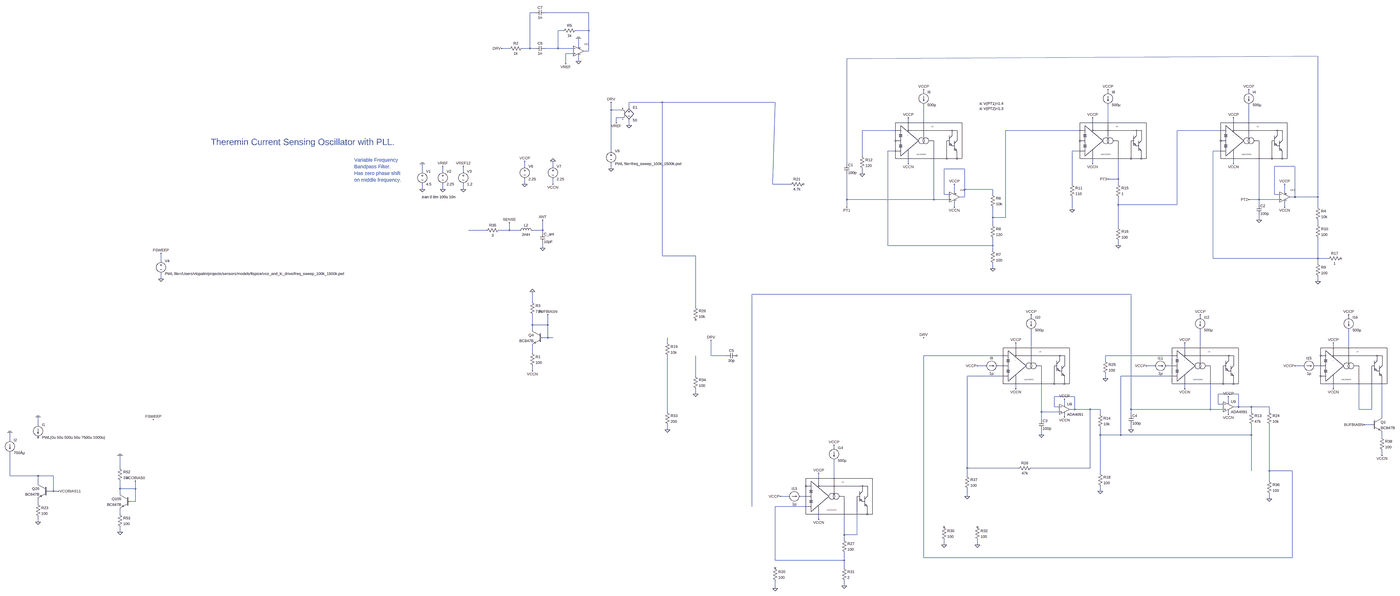
[diagram p0: schematic vco_and_lc_drive_v10.asc, whole sheet]
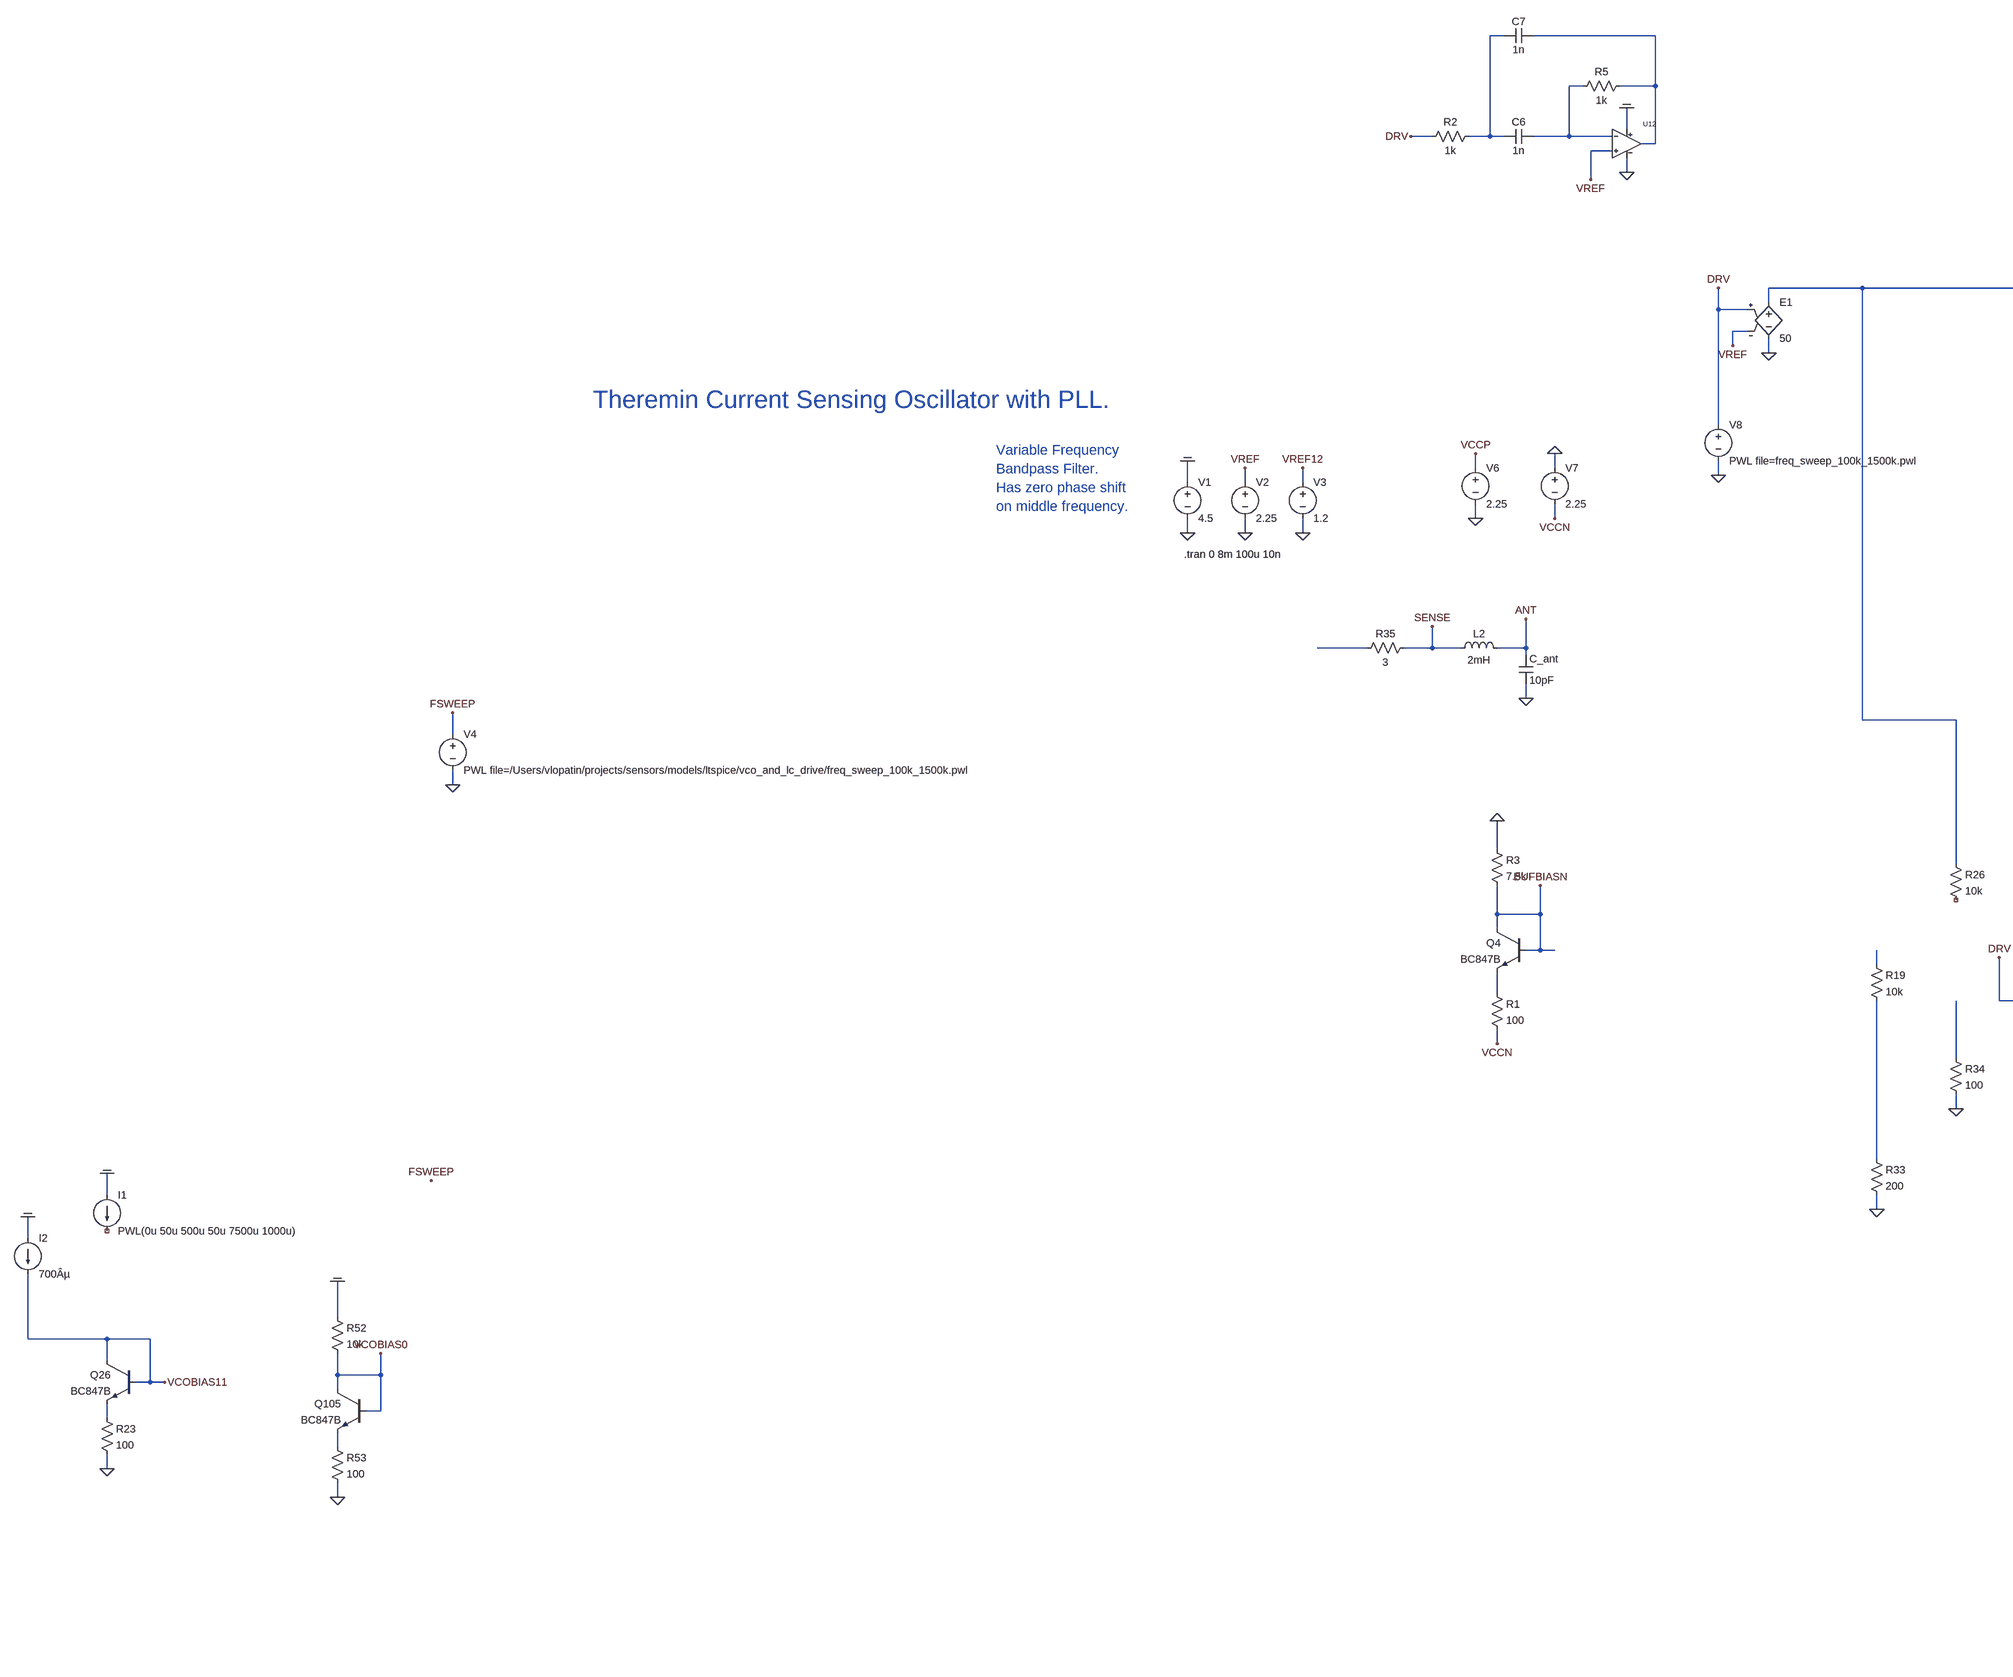
[diagram p1: schematic vco_and_lc_drive_v10.asc, part, row 1 of 1, column 1 of 2]
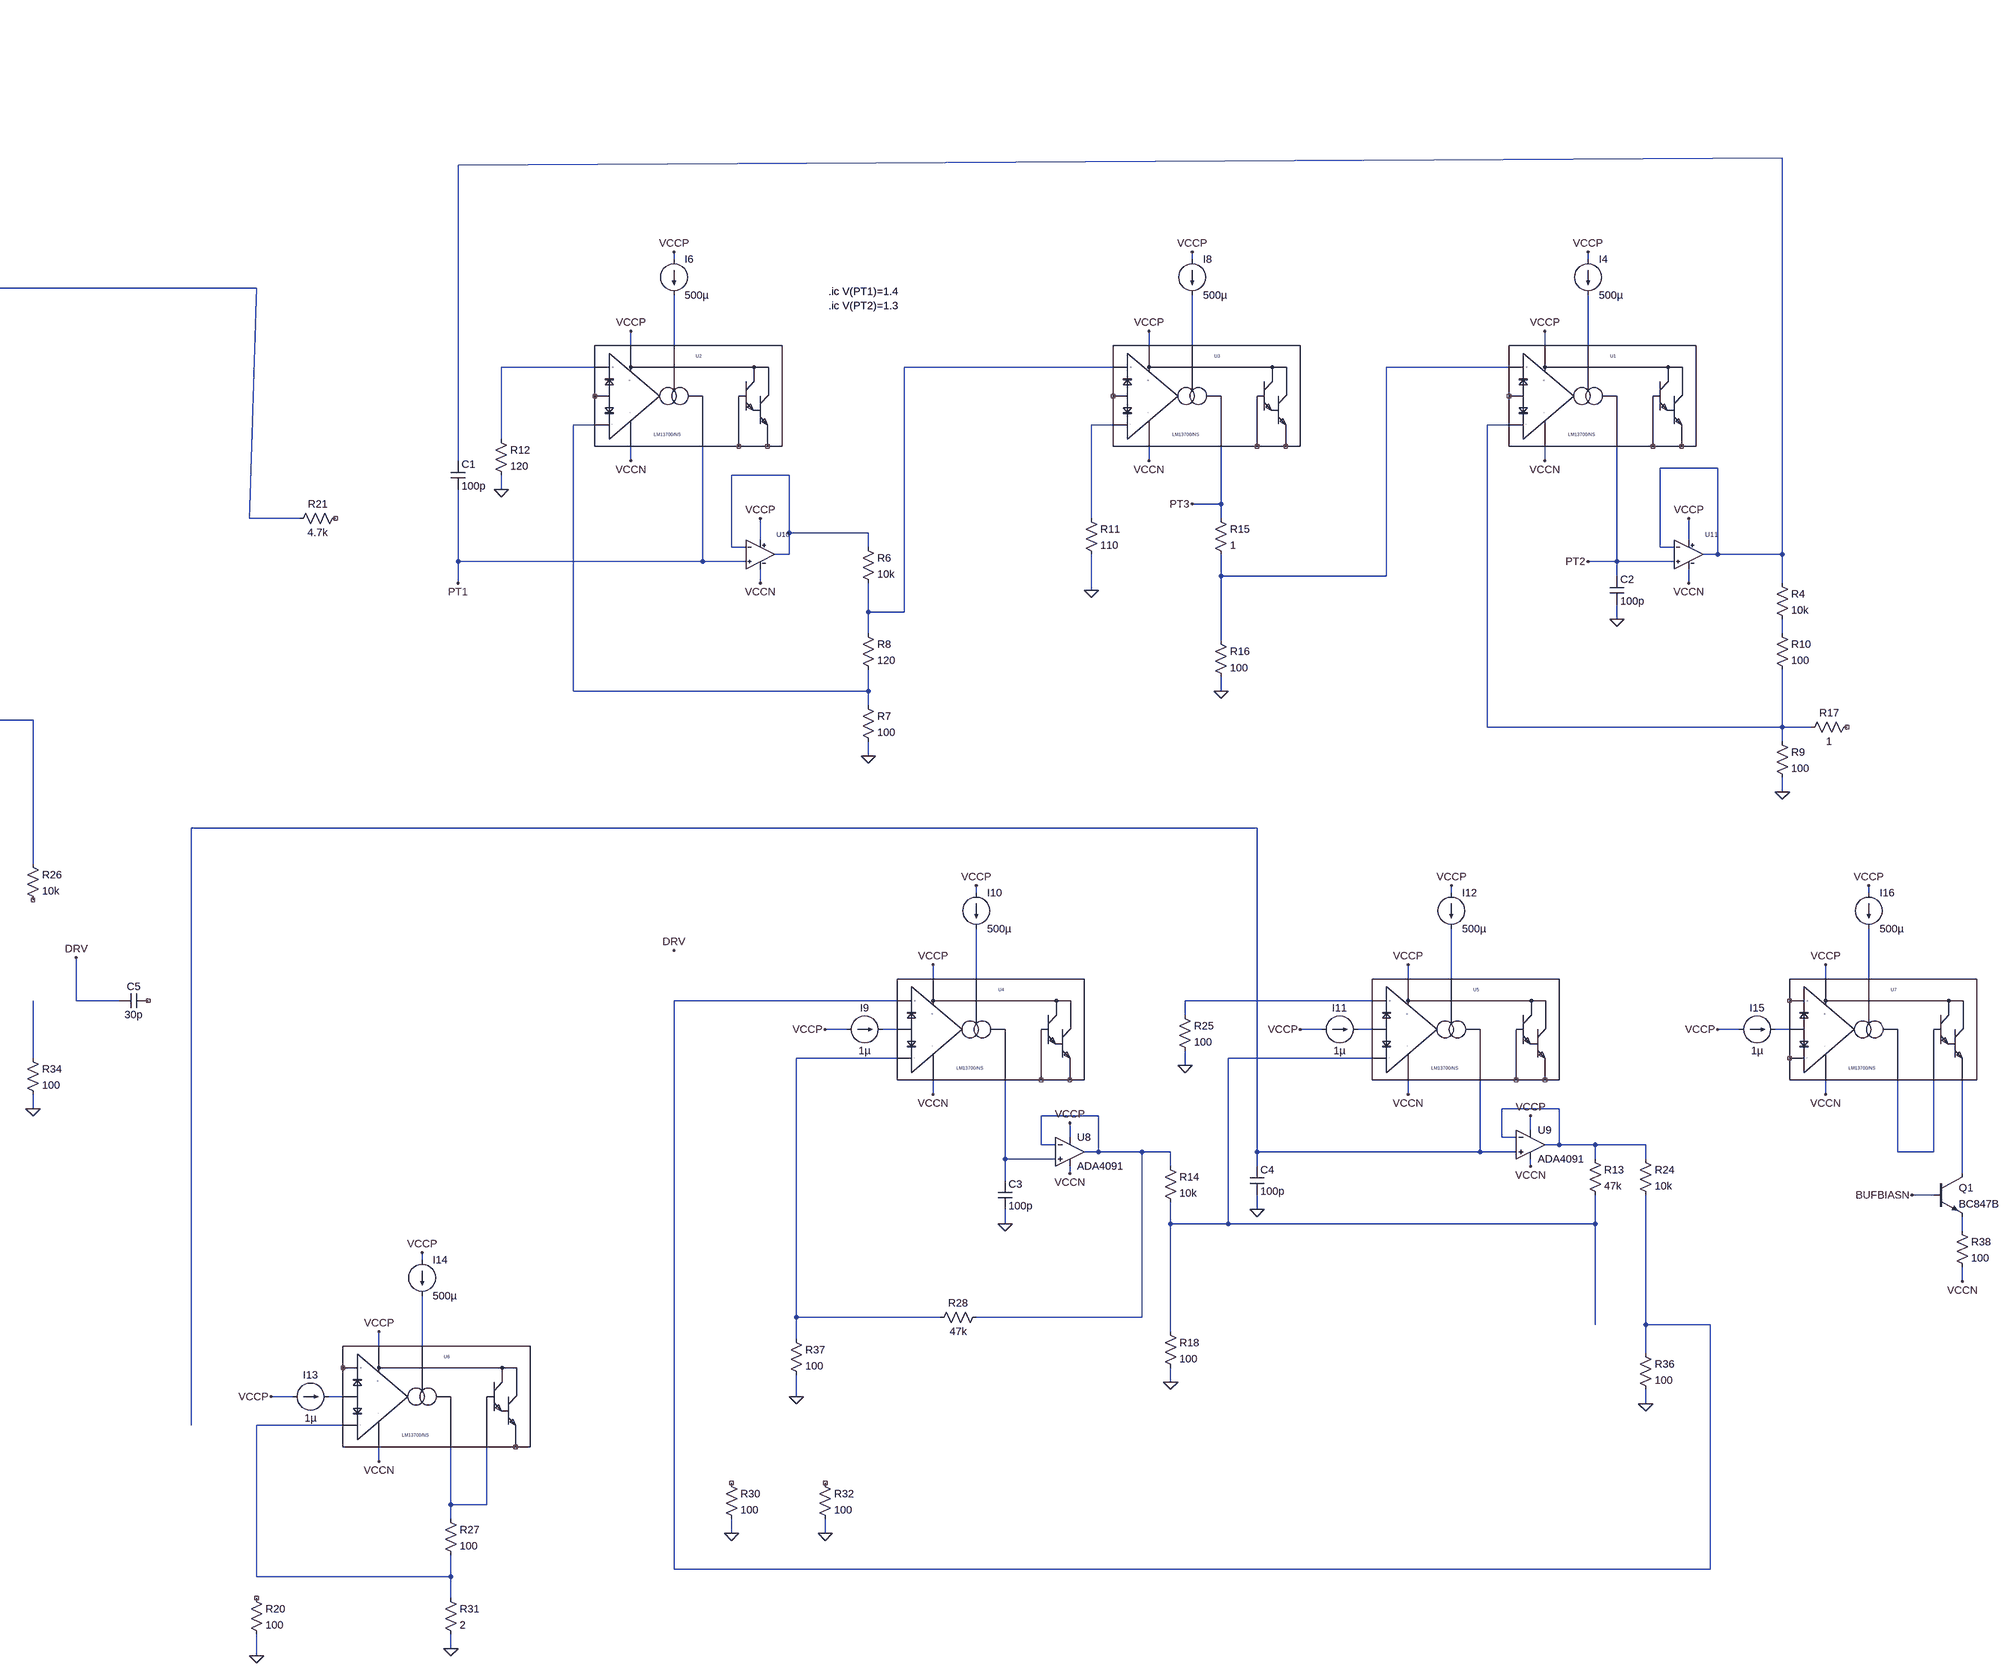
[diagram p2: schematic vco_and_lc_drive_v10.asc, part, row 1 of 1, column 2 of 2]
vco_and_lc_drive_v10.asc, the LTspice schematic file:
Version 4
SHEET 1 13504 24832
WIRE -4896 18064 -4928 18064
WIRE -4560 18064 -4832 18064
WIRE -4720 18176 -4752 18176
WIRE -4560 18176 -4560 18064
WIRE -4560 18176 -4640 18176
WIRE -4624 18272 -4624 18224
WIRE -5056 18288 -5104 18288
WIRE -4928 18288 -4928 18064
WIRE -4928 18288 -4976 18288
WIRE -4896 18288 -4928 18288
WIRE -4752 18288 -4752 18176
WIRE -4752 18288 -4832 18288
WIRE -4656 18288 -4752 18288
WIRE -4560 18304 -4560 18176
WIRE -4560 18304 -4592 18304
WIRE -4656 18320 -4704 18320
WIRE -1984 18352 960 18336
WIRE -4624 18368 -4624 18336
WIRE -4704 18384 -4704 18320
WIRE -1504 18576 -1504 18560
WIRE -352 18576 -352 18560
WIRE 528 18576 528 18560
WIRE -3232 18640 -3440 18640
WIRE -2432 18640 -3232 18640
WIRE -3440 18672 -3440 18640
WIRE -3552 18688 -3552 18640
WIRE -3488 18688 -3552 18688
WIRE -3488 18736 -3520 18736
WIRE -3520 18768 -3520 18736
WIRE -1600 18768 -1600 18736
WIRE -1504 18768 -1504 18656
WIRE -448 18768 -448 18736
WIRE -352 18768 -352 18656
WIRE 432 18768 432 18736
WIRE 528 18768 528 18656
WIRE -3440 18784 -3440 18752
WIRE -1680 18816 -1888 18816
WIRE -528 18816 -992 18816
WIRE 352 18816 80 18816
WIRE -3552 18944 -3552 18688
WIRE -1680 18944 -1728 18944
WIRE -528 18944 -576 18944
WIRE 352 18944 304 18944
WIRE -1888 18976 -1888 18816
WIRE -1984 19024 -1984 18352
WIRE -1600 19024 -1600 18992
WIRE -448 19024 -448 18992
WIRE 432 19024 432 18992
WIRE -4960 19040 -4960 19008
WIRE -4784 19040 -4784 19008
WIRE 816 19040 688 19040
WIRE -3552 19056 -3552 19024
WIRE -1248 19056 -1376 19056
WIRE -5600 19072 -5600 19024
WIRE -5472 19072 -5472 19040
WIRE -5344 19072 -5344 19040
WIRE -1888 19088 -1888 19056
WIRE -288 19120 -288 18992
WIRE -288 19120 -352 19120
WIRE -4960 19152 -4960 19120
WIRE -4784 19152 -4784 19120
WIRE -2448 19152 -2432 18640
WIRE -2336 19152 -2448 19152
WIRE -576 19152 -576 18944
WIRE -288 19152 -288 19120
WIRE -5600 19184 -5600 19152
WIRE -5472 19184 -5472 19152
WIRE -5344 19184 -5344 19152
WIRE -1248 19184 -1248 19056
WIRE -1072 19184 -1248 19184
WIRE -1312 19200 -1312 19152
WIRE 752 19200 752 19152
WIRE -1376 19216 -1376 19056
WIRE -1344 19216 -1376 19216
WIRE -1072 19216 -1072 19184
WIRE 688 19216 688 19040
WIRE 720 19216 688 19216
WIRE -1248 19232 -1248 19184
WIRE -1248 19232 -1280 19232
WIRE 816 19232 816 19040
WIRE 816 19232 784 19232
WIRE 960 19232 960 18336
WIRE 960 19232 816 19232
WIRE -1984 19248 -1984 19088
WIRE -1440 19248 -1440 18992
WIRE -1440 19248 -1984 19248
WIRE -1344 19248 -1440 19248
WIRE 592 19248 592 18992
WIRE 592 19248 528 19248
WIRE 720 19248 592 19248
WIRE -288 19280 -288 19232
WIRE 80 19280 80 18816
WIRE 80 19280 -288 19280
WIRE 592 19280 592 19248
WIRE -1984 19296 -1984 19248
WIRE -1312 19296 -1312 19264
WIRE 752 19296 752 19264
WIRE 960 19296 960 19232
WIRE -576 19312 -576 19232
WIRE -1072 19360 -1072 19296
WIRE -992 19360 -992 18816
WIRE -992 19360 -1072 19360
WIRE 592 19376 592 19344
WIRE -1072 19408 -1072 19360
WIRE 960 19408 960 19376
WIRE -288 19424 -288 19280
WIRE -5200 19440 -5312 19440
WIRE -5056 19440 -5056 19392
WIRE -5056 19440 -5120 19440
WIRE -4992 19440 -5056 19440
WIRE -4848 19440 -4848 19376
WIRE -4848 19440 -4912 19440
WIRE -4848 19456 -4848 19440
WIRE -1728 19536 -1728 18944
WIRE -1072 19536 -1072 19488
WIRE -1072 19536 -1728 19536
WIRE -288 19536 -288 19504
WIRE -4848 19552 -4848 19520
WIRE -1072 19568 -1072 19536
WIRE -3232 19600 -3232 18640
WIRE -3024 19600 -3232 19600
WIRE 304 19616 304 18944
WIRE 960 19616 960 19488
WIRE 960 19616 304 19616
WIRE 1024 19616 960 19616
WIRE -7648 19632 -7648 19584
WIRE 960 19648 960 19616
WIRE -1072 19680 -1072 19648
WIRE -7648 19744 -7648 19712
WIRE 960 19760 960 19728
WIRE -208 19840 -2672 19840
WIRE -4912 19888 -4912 19824
WIRE -3024 19920 -3024 19600
WIRE -832 19984 -832 19968
WIRE 224 19984 224 19968
WIRE 1152 19984 1152 19968
WIRE -4912 20032 -4912 19968
WIRE -4816 20032 -4816 19968
WIRE -4816 20032 -4912 20032
WIRE -4912 20064 -4912 20032
WIRE -4816 20112 -4816 20032
WIRE -4816 20112 -4848 20112
WIRE -4784 20112 -4816 20112
WIRE -3200 20144 -3200 20112
WIRE -928 20176 -928 20144
WIRE -832 20176 -832 20064
WIRE 128 20176 128 20144
WIRE 224 20176 224 20064
WIRE 1056 20176 1056 20144
WIRE 1152 20176 1152 20064
WIRE -4912 20208 -4912 20160
WIRE -2928 20224 -2928 20128
WIRE -2832 20224 -2928 20224
WIRE -1008 20224 -1504 20224
WIRE 48 20224 -368 20224
WIRE -368 20256 -368 20224
WIRE -1120 20288 -1168 20288
WIRE -1008 20288 -1040 20288
WIRE -64 20288 -112 20288
WIRE 48 20288 16 20288
WIRE 864 20288 816 20288
WIRE 976 20288 944 20288
WIRE -4912 20320 -4912 20288
WIRE -3024 20352 -3024 20224
WIRE -1008 20352 -1232 20352
WIRE 48 20352 -272 20352
WIRE -368 20368 -368 20336
WIRE -928 20432 -928 20400
WIRE 128 20432 128 20400
WIRE 1056 20432 1056 20400
WIRE -3024 20464 -3024 20432
WIRE 464 20464 336 20464
WIRE -560 20480 -688 20480
WIRE 400 20512 400 20480
WIRE -624 20528 -624 20496
WIRE 336 20528 336 20464
WIRE 368 20528 336 20528
WIRE -688 20544 -688 20480
WIRE -656 20544 -688 20544
WIRE 464 20544 464 20464
WIRE 464 20544 432 20544
WIRE 544 20544 464 20544
WIRE 656 20544 544 20544
WIRE -560 20560 -560 20480
WIRE -560 20560 -592 20560
WIRE -464 20560 -560 20560
WIRE -400 20560 -464 20560
WIRE -208 20560 -208 19840
WIRE 288 20560 288 20400
WIRE 288 20560 -208 20560
WIRE 368 20560 288 20560
WIRE 1216 20560 1216 20400
WIRE 1296 20560 1296 20400
WIRE 1296 20560 1216 20560
WIRE -3200 20576 -3200 20224
WIRE -768 20576 -768 20400
WIRE -656 20576 -768 20576
WIRE 544 20576 544 20544
WIRE 656 20576 656 20544
WIRE -400 20592 -400 20560
WIRE -208 20592 -208 20560
WIRE 400 20592 400 20576
WIRE -624 20608 -624 20592
WIRE 1360 20608 1360 20400
WIRE -768 20624 -768 20576
WIRE -8416 20656 -8416 20608
WIRE 1296 20656 1248 20656
WIRE -3200 20688 -3200 20656
WIRE -208 20688 -208 20656
WIRE -768 20720 -768 20688
WIRE -400 20720 -400 20672
WIRE -272 20720 -272 20352
WIRE -272 20720 -400 20720
WIRE 544 20720 544 20656
WIRE 544 20720 -272 20720
WIRE 1360 20736 1360 20704
WIRE -8592 20752 -8592 20704
WIRE -2064 20800 -2064 20784
WIRE 1360 20848 1360 20816
WIRE -7904 20928 -7904 20848
WIRE -1232 20928 -1232 20352
WIRE -912 20928 -1232 20928
WIRE -464 20928 -464 20560
WIRE -464 20928 -832 20928
WIRE 544 20944 544 20720
WIRE 656 20944 656 20656
WIRE 800 20944 656 20944
WIRE -400 20960 -400 20720
WIRE -8592 20976 -8592 20832
WIRE -8416 20976 -8592 20976
WIRE -8320 20976 -8416 20976
WIRE -1232 20976 -1232 20928
WIRE -2160 20992 -2160 20960
WIRE -2064 20992 -2064 20880
WIRE 656 21008 656 20944
WIRE -8416 21024 -8416 20976
WIRE -7904 21056 -7904 21008
WIRE -7808 21056 -7808 21008
WIRE -7808 21056 -7904 21056
WIRE -8320 21072 -8320 20976
WIRE -8320 21072 -8352 21072
WIRE -8288 21072 -8320 21072
WIRE -400 21072 -400 21040
WIRE -7904 21088 -7904 21056
WIRE -2352 21104 -2400 21104
WIRE -2240 21104 -2272 21104
WIRE -1232 21104 -1232 21056
WIRE 656 21120 656 21088
WIRE -7808 21136 -7808 21056
WIRE -7808 21136 -7840 21136
WIRE -8416 21152 -8416 21120
WIRE -2672 21168 -2672 19840
WIRE -2240 21168 -2432 21168
WIRE -7904 21216 -7904 21184
WIRE -2160 21248 -2160 21216
WIRE -8416 21264 -8416 21232
WIRE -7904 21328 -7904 21296
WIRE -2000 21344 -2000 21216
WIRE -1920 21344 -1920 21216
WIRE -1920 21344 -2000 21344
WIRE -2000 21376 -2000 21344
WIRE -1376 21408 -1376 21376
WIRE -1168 21408 -1168 21376
WIRE -1504 21488 -1504 20224
WIRE 800 21488 800 20944
WIRE 800 21488 -1504 21488
WIRE -2432 21504 -2432 21168
WIRE -2000 21504 -2000 21456
WIRE -2000 21504 -2432 21504
WIRE -2000 21552 -2000 21504
WIRE -2000 21664 -2000 21632
WIRE -2432 21680 -2432 21632
FLAG -5600 19184 0
FLAG -5600 19024 COM
FLAG -5472 19184 0
FLAG -5472 19040 VREF
FLAG -4848 19552 0
FLAG -4848 19376 ANT
FLAG -5056 19392 SENSE
FLAG -5344 19184 0
FLAG -5344 19040 VREF12
FLAG -8416 20608 COM
FLAG -8288 21072 VCOBIAS11
FLAG -8416 21264 0
FLAG -7904 20848 COM
FLAG -7904 21328 0
FLAG -7808 21008 VCOBIAS0
FLAG -7648 19744 0
FLAG -7648 19584 FSWEEP
FLAG -8592 20704 COM
FLAG -7696 20624 FSWEEP
FLAG -4960 19152 0
FLAG -4960 19008 VCCP
FLAG -4784 19008 0
FLAG -4784 19152 VCCN
FLAG 432 18736 VCCP
FLAG 432 19024 VCCN
FLAG 528 18560 VCCP
FLAG -4912 20320 VCCN
FLAG -4912 19824 0
FLAG -4816 19968 BUFBIASN
FLAG 960 19760 0
FLAG 592 19376 0
FLAG -3552 19056 0
FLAG -1600 18736 VCCP
FLAG -1600 19024 VCCN
FLAG -1504 18560 VCCP
FLAG -1072 19680 0
FLAG -3440 18784 0
FLAG -3520 18768 VREF
FLAG -1984 19296 PT1
FLAG 528 19248 PT2
FLAG -448 18736 VCCP
FLAG -448 19024 VCCN
FLAG -352 18560 VCCP
FLAG -352 19120 PT3
FLAG -288 19536 0
FLAG -576 19312 0
FLAG -1888 19088 0
FLAG -928 20144 VCCP
FLAG -928 20432 VCCN
FLAG -1168 20288 VCCP
FLAG -832 19968 VCCP
FLAG -400 21072 0
FLAG -768 20720 0
FLAG 128 20144 VCCP
FLAG 128 20432 VCCN
FLAG -112 20288 VCCP
FLAG 224 19968 VCCP
FLAG -368 20368 0
FLAG -1376 21408 0
FLAG -2160 20960 VCCP
FLAG -2160 21248 VCCN
FLAG -2400 21104 VCCP
FLAG -2064 20784 VCCP
FLAG -2000 21664 0
FLAG -1168 21408 0
FLAG -3200 20688 0
FLAG -3024 20464 0
FLAG -2432 21680 0
FLAG -1232 21104 0
FLAG -3552 18640 DRV
FLAG -2928 20128 DRV
FLAG 656 21120 0
FLAG 1056 20144 VCCP
FLAG 1056 20432 VCCN
FLAG 816 20288 VCCP
FLAG 1152 19968 VCCP
FLAG 1360 20848 VCCN
FLAG 1248 20656 BUFBIASN
FLAG -624 20496 VCCP
FLAG -624 20608 VCCN
FLAG 400 20480 VCCP
FLAG 400 20592 VCCN
FLAG -1504 20112 DRV
FLAG -208 20688 0
FLAG -1312 19296 VCCN
FLAG -1312 19152 VCCP
FLAG 752 19296 VCCN
FLAG 752 19152 VCCP
FLAG -5104 18288 DRV
FLAG -4624 18368 0
FLAG -4624 18224 COM
FLAG -4704 18384 VREF
SYMBOL voltage -5600 19056 R0
SYMATTR InstName V1
SYMATTR Value 4.5
SYMBOL Voltage -5472 19056 R0
SYMATTR InstName V2
SYMATTR Value 2.25
SYMBOL ind -5008 19456 R270
WINDOW 0 32 56 VTop 2
WINDOW 3 5 56 VBottom 2
SYMATTR InstName L2
SYMATTR Value 2mH
SYMATTR SpiceLine Rser=120 Cpar=1pF
SYMBOL Cap -4864 19456 R0
SYMATTR InstName C_ant
SYMATTR Value 10pF
SYMBOL Res -5216 19456 R270
WINDOW 0 32 56 VTop 2
WINDOW 3 0 56 VBottom 2
SYMATTR InstName R35
SYMATTR Value 3
SYMBOL Voltage -5344 19056 R0
SYMATTR InstName V3
SYMATTR Value 1.2
SYMBOL npn -8352 21024 M0
SYMATTR InstName Q26
SYMATTR Value BC847B
SYMBOL Res -8432 21136 R0
SYMATTR InstName R23
SYMATTR Value 100
SYMBOL current -8416 20656 R0
SYMATTR InstName I1
SYMATTR Value PWL(0u 50u 500u 50u 7500u 1000u)
SYMBOL npn -7840 21088 M0
SYMATTR InstName Q105
SYMATTR Value BC847B
SYMBOL Res -7920 20912 R0
SYMATTR InstName R52
SYMATTR Value 10k
SYMBOL Res -7920 21200 R0
SYMATTR InstName R53
SYMATTR Value 100
SYMBOL Voltage -7648 19616 R0
SYMATTR InstName V4
SYMATTR Value PWL file=/Users/vlopatin/projects/sensors/models/ltspice/vco_and_lc_drive/freq_sweep_100k_1500k.pwl
SYMBOL current -8592 20752 R0
SYMATTR InstName I2
SYMATTR Value 700Âµ
SYMBOL Voltage -4960 19024 R0
SYMATTR InstName V6
SYMATTR Value 2.25
SYMBOL Voltage -4784 19024 R0
SYMATTR InstName V7
SYMATTR Value 2.25
SYMBOL LM13700 432 18880 R0
SYMATTR InstName U1
SYMBOL current 528 18576 R0
SYMATTR InstName I4
SYMATTR Value 500µ
SYMBOL npn -4848 20064 M0
SYMATTR InstName Q4
SYMATTR Value BC847B
SYMBOL Res -4928 20192 R0
SYMATTR InstName R1
SYMATTR Value 100
SYMBOL Res -4928 19872 R0
SYMATTR InstName R3
SYMATTR Value 7.5k
SYMBOL Res 944 19280 R0
SYMATTR InstName R4
SYMATTR Value 10k
SYMBOL Res 944 19632 R0
SYMATTR InstName R9
SYMATTR Value 100
SYMBOL Res 944 19392 R0
SYMATTR InstName R10
SYMATTR Value 100
SYMBOL Cap 576 19280 R0
SYMATTR InstName C2
SYMATTR Value 100p
SYMBOL Voltage -3552 18928 R0
SYMATTR InstName V8
SYMATTR Value PWL file=freq_sweep_100k_1500k.pwl
SYMBOL LM13700 -1600 18880 R0
SYMATTR InstName U2
SYMBOL current -1504 18576 R0
SYMATTR InstName I6
SYMATTR Value 500µ
SYMBOL Res -1088 19200 R0
SYMATTR InstName R6
SYMATTR Value 10k
SYMBOL Res -1088 19552 R0
SYMATTR InstName R7
SYMATTR Value 100
SYMBOL Res -1088 19392 R0
SYMATTR InstName R8
SYMATTR Value 120
SYMBOL Cap -2000 19024 R0
SYMATTR InstName C1
SYMATTR Value 100p
SYMBOL e -3440 18656 R0
SYMATTR InstName E1
SYMATTR Value 50
SYMBOL LM13700 -448 18880 R0
SYMATTR InstName U3
SYMBOL current -352 18576 R0
SYMATTR InstName I8
SYMATTR Value 500µ
SYMBOL Res -304 19136 R0
SYMATTR InstName R15
SYMATTR Value 1
SYMBOL Res -304 19408 R0
SYMATTR InstName R16
SYMATTR Value 100
SYMBOL Res 1120 19600 R90
WINDOW 0 0 56 VBottom 2
WINDOW 3 32 56 VTop 2
SYMATTR InstName R17
SYMATTR Value 1
SYMBOL Res -592 19136 R0
SYMATTR InstName R11
SYMATTR Value 110
SYMBOL Res -1904 18960 R0
SYMATTR InstName R12
SYMATTR Value 120
SYMBOL LM13700 -928 20288 R0
SYMATTR InstName U4
SYMBOL current -1120 20288 R270
WINDOW 0 32 40 VTop 2
WINDOW 3 -32 40 VBottom 2
SYMATTR InstName I9
SYMATTR Value 1µ
SYMBOL current -832 19984 R0
SYMATTR InstName I10
SYMATTR Value 500µ
SYMBOL Res -416 20576 R0
SYMATTR InstName R14
SYMATTR Value 10k
SYMBOL Res -416 20944 R0
SYMATTR InstName R18
SYMATTR Value 100
SYMBOL Cap -784 20624 R0
SYMATTR InstName C3
SYMATTR Value 100p
SYMBOL Res -2240 19136 R90
WINDOW 0 0 56 VBottom 2
WINDOW 3 32 56 VTop 2
SYMATTR InstName R21
SYMATTR Value 4.7k
SYMBOL LM13700 128 20288 R0
SYMATTR InstName U5
SYMBOL current -64 20288 R270
WINDOW 0 32 40 VTop 2
WINDOW 3 -32 40 VBottom 2
SYMATTR InstName I11
SYMATTR Value 1µ
SYMBOL current 224 19984 R0
SYMATTR InstName I12
SYMATTR Value 500µ
SYMBOL Res 640 20560 R0
SYMATTR InstName R24
SYMATTR Value 10k
SYMBOL Res -384 20240 R0
SYMATTR InstName R25
SYMATTR Value 100
SYMBOL Res -816 20912 R90
WINDOW 0 0 56 VBottom 2
WINDOW 3 32 56 VTop 2
SYMATTR InstName R28
SYMATTR Value 47k
SYMBOL Res -1392 21280 R0
SYMATTR InstName R30
SYMATTR Value 100
SYMBOL LM13700 -2160 21104 R0
SYMATTR InstName U6
SYMBOL current -2352 21104 R270
WINDOW 0 32 40 VTop 2
WINDOW 3 -32 40 VBottom 2
SYMATTR InstName I13
SYMATTR Value 1µ
SYMBOL current -2064 20800 R0
SYMATTR InstName I14
SYMATTR Value 500µ
SYMBOL Res -2016 21360 R0
SYMATTR InstName R27
SYMATTR Value 100
SYMBOL Res -2016 21536 R0
SYMATTR InstName R31
SYMATTR Value 2
SYMBOL Res -3040 19904 R0
SYMATTR InstName R26
SYMATTR Value 10k
SYMBOL Res -1184 21280 R0
SYMATTR InstName R32
SYMATTR Value 100
SYMBOL Res -3216 20128 R0
SYMATTR InstName R19
SYMATTR Value 10k
SYMBOL Res -3216 20560 R0
SYMATTR InstName R33
SYMATTR Value 200
SYMBOL Res -2448 21536 R0
SYMATTR InstName R20
SYMATTR Value 100
SYMBOL Res -3040 20336 R0
SYMATTR InstName R34
SYMATTR Value 100
SYMBOL Res -1248 20960 R0
SYMATTR InstName R37
SYMATTR Value 100
SYMBOL Cap -2768 20208 R90
WINDOW 0 0 32 VBottom 2
WINDOW 3 32 32 VTop 2
SYMATTR InstName C5
SYMATTR Value 30p
SYMBOL Res 640 20992 R0
SYMATTR InstName R36
SYMATTR Value 100
SYMBOL LM13700 1056 20288 R0
SYMATTR InstName U7
SYMBOL current 864 20288 R270
WINDOW 0 32 40 VTop 2
WINDOW 3 -32 40 VBottom 2
SYMATTR InstName I15
SYMATTR Value 1µ
SYMBOL current 1152 19984 R0
SYMATTR InstName I16
SYMATTR Value 500µ
SYMBOL npn 1296 20608 R0
SYMATTR InstName Q1
SYMATTR Value BC847B
SYMBOL Res 1344 20720 R0
SYMATTR InstName R38
SYMATTR Value 100
SYMBOL OpAmps/ADA4091 -624 20496 R0
SYMATTR InstName U8
SYMBOL OpAmps/ADA4091 400 20480 R0
SYMATTR InstName U9
SYMBOL Res 528 20560 R0
SYMATTR InstName R13
SYMATTR Value 47k
SYMBOL Cap -224 20592 R0
SYMATTR InstName C4
SYMATTR Value 100p
SYMBOL MCP6021 -1312 19232 R0
SYMATTR InstName U10
SYMBOL MCP6021 752 19232 R0
SYMATTR InstName U11
SYMBOL Res -4960 18272 R90
WINDOW 0 0 56 VBottom 2
WINDOW 3 32 56 VTop 2
SYMATTR InstName R2
SYMATTR Value 1k
SYMBOL Cap -4832 18272 R90
WINDOW 0 0 32 VBottom 2
WINDOW 3 32 32 VTop 2
SYMATTR InstName C6
SYMATTR Value 1n
SYMBOL Cap -4832 18048 R90
WINDOW 0 0 32 VBottom 2
WINDOW 3 32 32 VTop 2
SYMATTR InstName C7
SYMATTR Value 1n
SYMBOL Res -4624 18160 R90
WINDOW 0 0 56 VBottom 2
WINDOW 3 32 56 VTop 2
SYMATTR InstName R5
SYMATTR Value 1k
SYMBOL MCP6021 -4624 18304 R0
SYMATTR InstName U12
TEXT -5608 19232 Left 2 !.tran 0 8m 100u 10n
TEXT -7336 18888 Left 5 ;Theremin Current Sensing Oscillator with PLL.
TEXT -6440 19000 Left 3 ;Variable Frequency \nBandpass Filter.\nHas zero phase shift \non middle frequency.
TEXT -1160 18648 Left 2 !.ic V(PT1)=1.4\n.ic V(PT2)=1.3

The netlist it stands for:
* vco_and_lc_drive_v10.asc
V1 COM 0 4.5
V2 VREF 0 2.25
L2 SENSE ANT 2mH Rser=120 Cpar=1pF
C_ant ANT 0 10pF
R35 N017 SENSE 3
V3 VREF12 0 1.2
Q26 VCOBIAS11 VCOBIAS11 N041 0 BC847B
R23 N041 0 100
I1 COM NC_01 PWL(0u 50u 500u 50u 7500u 1000u)
Q105 VCOBIAS0 VCOBIAS0 N043 0 BC847B
R52 COM VCOBIAS0 10k
R53 N043 0 100
V4 FSWEEP 0 PWL file=/Users/vlopatin/projects/sensors/models/ltspice/vco_and_lc_drive/freq_sweep_100k_1500k.pwl
I2 COM VCOBIAS11 700Âµ
V6 VCCP 0 2.25
V7 0 VCCN 2.25
XU1 N008 NC_02 N011 N014 PT2 VCCN NC_03 NC_04 VCCP LM13700/NS  ; pins Ibias Dio_bias in+ in- out V- buf_in buf_out V+
I4 VCCP N008 500µ
Q4 BUFBIASN BUFBIASN N023 0 BC847B
R1 N023 VCCN 100
R3 0 BUFBIASN 7.5k
R4 N004 N016 10k
R9 N014 0 100
R10 N016 N014 100
C2 PT2 0 100p
V8 DRV 0 PWL file=freq_sweep_100k_1500k.pwl
XU2 N006 NC_05 N009 N012 PT1 VCCN NC_06 NC_07 VCCP LM13700/NS  ; pins Ibias Dio_bias in+ in- out V- buf_in buf_out V+
I6 VCCP N006 500µ
R6 N015 N010 10k
R7 N012 0 100
R8 N010 N012 120
C1 N004 PT1 100p
E1 N005 0 DRV VREF 50
XU3 N007 NC_08 N010 N013 PT3 VCCN NC_09 NC_10 VCCP LM13700/NS  ; pins Ibias Dio_bias in+ in- out V- buf_in buf_out V+
I8 VCCP N007 500µ
R15 PT3 N011 1
R16 N011 0 100
R17 NC_11 N014 1
R11 N013 0 110
R12 N009 0 120
XU4 N020 N026 N024 N030 N036 VCCN NC_12 NC_13 VCCP LM13700/NS  ; pins Ibias Dio_bias in+ in- out V- buf_in buf_out V+
I9 VCCP N026 1µ
I10 VCCP N020 500µ
R14 N033 N031 10k
R18 N031 0 100
C3 N036 0 100p
R21 NC_14 N005 4.7k
XU5 N021 N027 N025 N031 N018 VCCN NC_15 NC_16 VCCP LM13700/NS  ; pins Ibias Dio_bias in+ in- out V- buf_in buf_out V+
I11 VCCP N027 1µ
I12 VCCP N021 500µ
R24 N032 N024 10k
R25 N025 0 100
R28 N033 N030 47k
R30 NC_17 0 100
XU6 N039 N040 NC_18 N042 N044 VCCN N044 NC_19 VCCP LM13700/NS  ; pins Ibias Dio_bias in+ in- out V- buf_in buf_out V+
I13 VCCP N040 1µ
I14 VCCP N039 500µ
R27 N044 N042 100
R31 N042 0 2
R26 N005 NC_20 10k
R32 NC_21 0 100
R19 N019 N035 10k
R33 N035 0 200
R20 NC_22 0 100
R34 N029 0 100
R37 N030 0 100
C5 NC_23 DRV 30p
R36 N024 0 100
XU7 N022 N028 NC_24 NC_25 N034 VCCN N034 N037 VCCP LM13700/NS  ; pins Ibias Dio_bias in+ in- out V- buf_in buf_out V+
I15 VCCP N028 1µ
I16 VCCP N022 500µ
Q1 N037 BUFBIASN N038 0 BC847B
R38 N038 VCCN 100
XU8 N036 N033 VCCP VCCN N033 ADA4091  ; pins In+ In- V+ V- OUT
XU9 N018 N032 VCCP VCCN N032 ADA4091  ; pins In+ In- V+ V- OUT
R13 N032 N031 47k
C4 N018 0 100p
XU10 PT1 N015 VCCP VCCN N015 MCP6021  ; pins In+ In- V+ V- OUT
XU11 PT2 N004 VCCP VCCN N004 MCP6021  ; pins In+ In- V+ V- OUT
R2 N001 DRV 1k
C6 N003 N001 1n
C7 N002 N001 1n
R5 N002 N003 1k
XU12 VREF N003 COM 0 N002 MCP6021  ; pins In+ In- V+ V- OUT
.model NPN NPN
.model PNP PNP
.lib standard.bjt
.tran 0 8m 100u 10n
* Theremin Current Sensing Oscillator with PLL.
* Variable Frequency
* Bandpass Filter.
* Has zero phase shift
* on middle frequency.
.ic V(PT1)=1.4
.ic V(PT2)=1.3
.lib ns_models.lib
.lib ADI.lib
.lib MCP6021.cir
.backanno
.end